# EAGLE schematic FINAL8x64 LED DIGITAL DISPLAY VERSION 1.0 CONNECTION REMANING v8 (EAGLE 9.7.0)
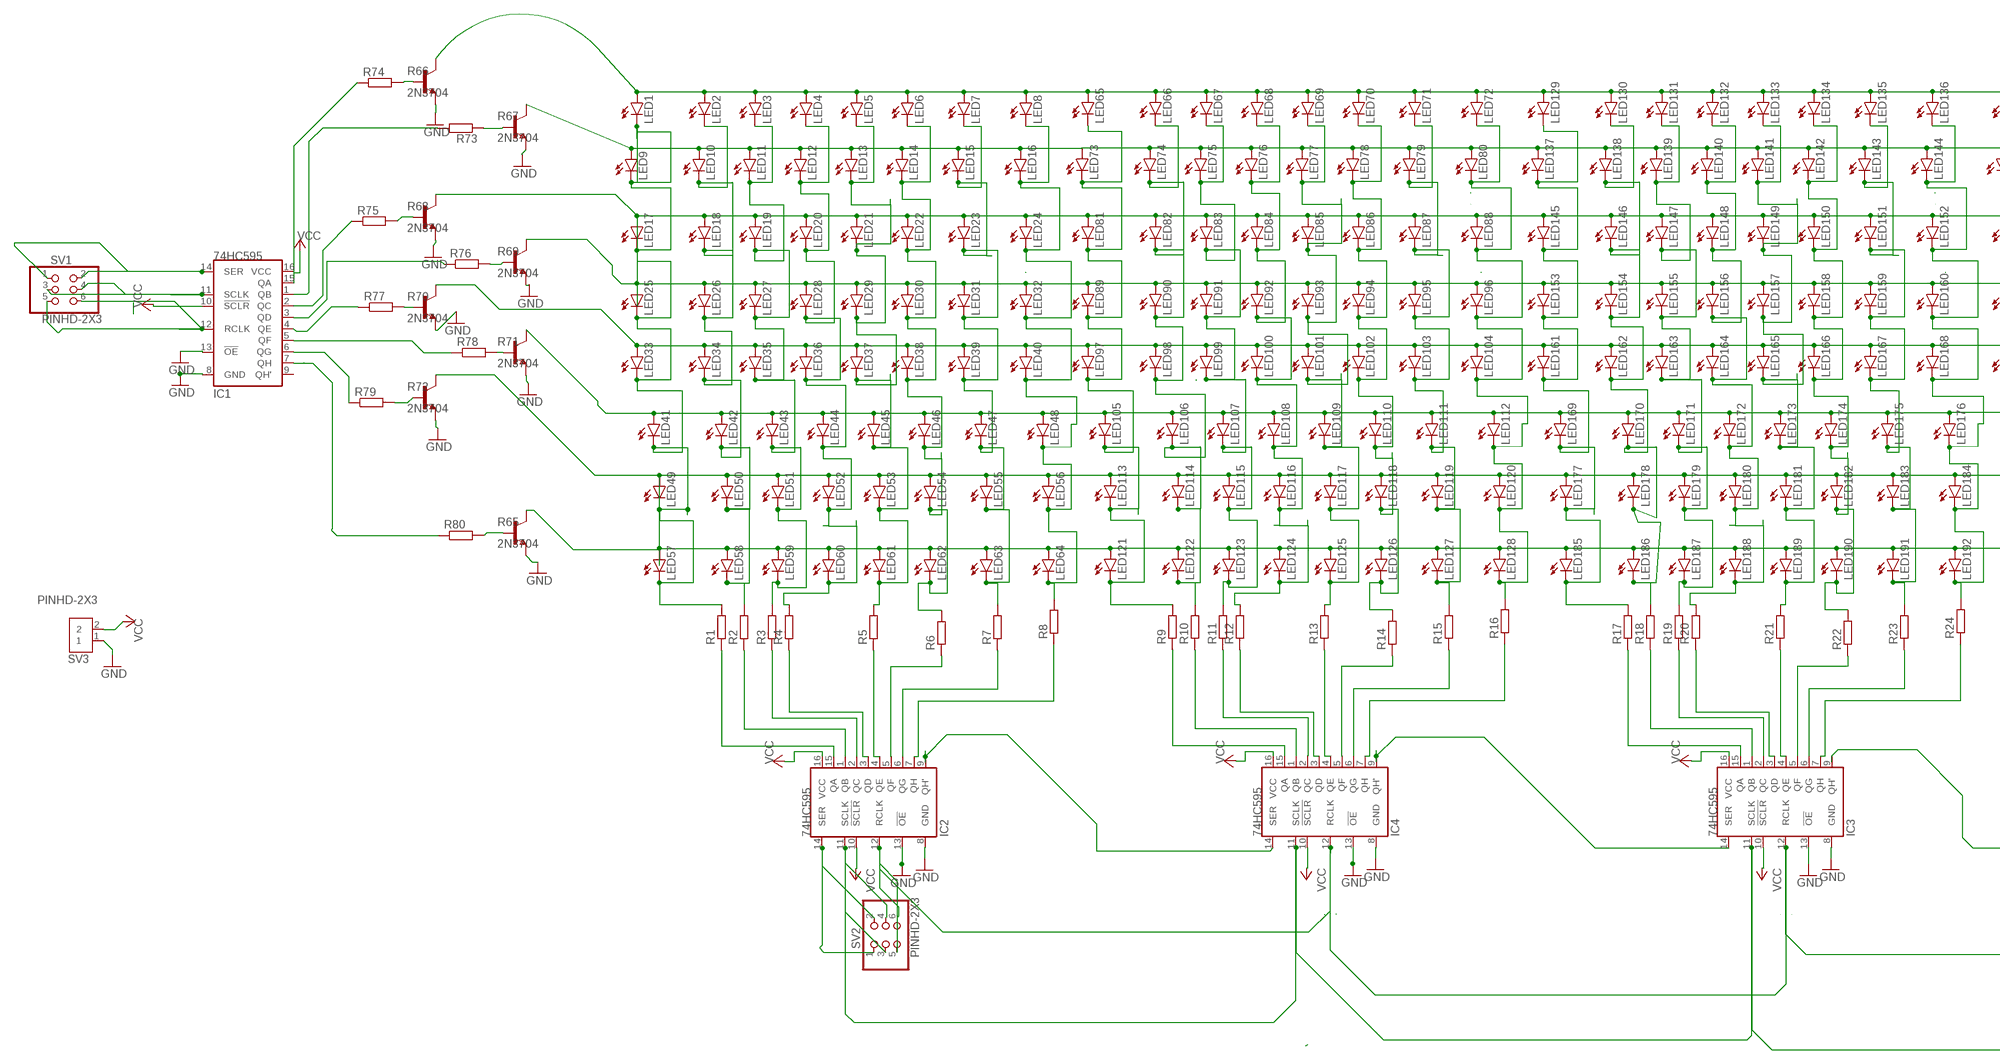
[diagram p0: schematic, sheet 1, part 1 of 2]
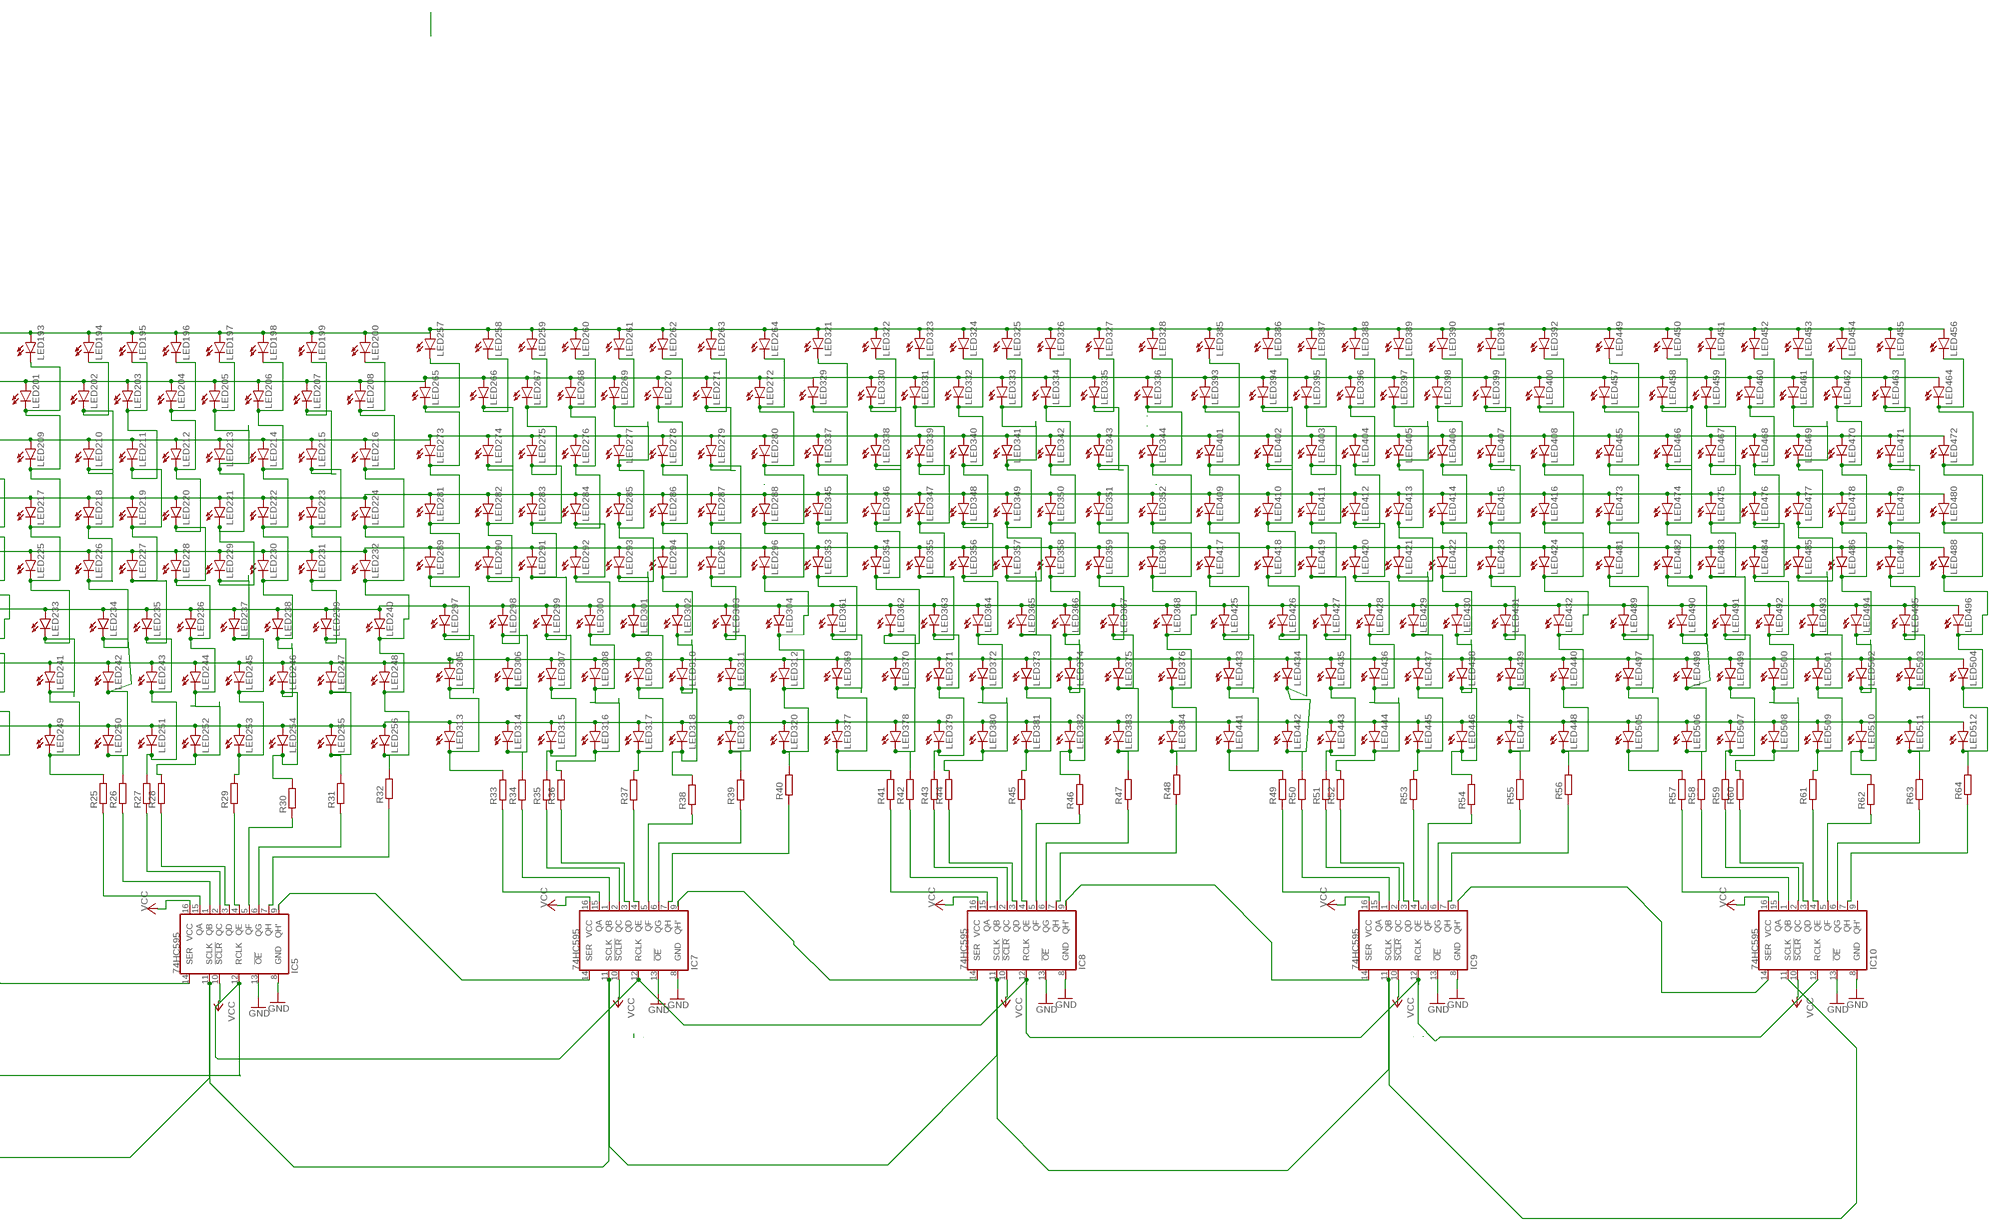
[diagram p1: schematic, sheet 1, part 2 of 2]

## Parts
IC1  74HC595  [SO16]
IC2  74HC595  [SO16]
IC3  74HC595  [SO16]
IC4  74HC595  [SO16]
IC5  74HC595  [SO16]
IC7  74HC595  [SO16]
IC8  74HC595  [SO16]
IC9  74HC595  [SO16]
IC10  74HC595  [SO16]
LED1  LED5MM  [LED5MM]
LED2  LED5MM  [LED5MM]
LED3  LED5MM  [LED5MM]
LED4  LED5MM  [LED5MM]
LED5  LED5MM  [LED5MM]
LED6  LED5MM  [LED5MM]
LED7  LED5MM  [LED5MM]
LED8  LED5MM  [LED5MM]
LED9  LED5MM  [LED5MM]
LED10  LED5MM  [LED5MM]
LED11  LED5MM  [LED5MM]
LED12  LED5MM  [LED5MM]
LED13  LED5MM  [LED5MM]
LED14  LED5MM  [LED5MM]
LED15  LED5MM  [LED5MM]
LED16  LED5MM  [LED5MM]
LED17  LED5MM  [LED5MM]
LED18  LED5MM  [LED5MM]
LED19  LED5MM  [LED5MM]
LED20  LED5MM  [LED5MM]
LED21  LED5MM  [LED5MM]
LED22  LED5MM  [LED5MM]
LED23  LED5MM  [LED5MM]
LED24  LED5MM  [LED5MM]
LED25  LED5MM  [LED5MM]
LED26  LED5MM  [LED5MM]
LED27  LED5MM  [LED5MM]
LED28  LED5MM  [LED5MM]
LED29  LED5MM  [LED5MM]
LED30  LED5MM  [LED5MM]
LED31  LED5MM  [LED5MM]
LED32  LED5MM  [LED5MM]
LED33  LED5MM  [LED5MM]
LED34  LED5MM  [LED5MM]
LED35  LED5MM  [LED5MM]
LED36  LED5MM  [LED5MM]
LED37  LED5MM  [LED5MM]
LED38  LED5MM  [LED5MM]
LED39  LED5MM  [LED5MM]
LED40  LED5MM  [LED5MM]
LED41  LED5MM  [LED5MM]
LED42  LED5MM  [LED5MM]
LED43  LED5MM  [LED5MM]
LED44  LED5MM  [LED5MM]
LED45  LED5MM  [LED5MM]
LED46  LED5MM  [LED5MM]
LED47  LED5MM  [LED5MM]
LED48  LED5MM  [LED5MM]
LED49  LED5MM  [LED5MM]
LED50  LED5MM  [LED5MM]
LED51  LED5MM  [LED5MM]
LED52  LED5MM  [LED5MM]
LED53  LED5MM  [LED5MM]
LED54  LED5MM  [LED5MM]
LED55  LED5MM  [LED5MM]
LED56  LED5MM  [LED5MM]
LED57  LED5MM  [LED5MM]
LED58  LED5MM  [LED5MM]
LED59  LED5MM  [LED5MM]
LED60  LED5MM  [LED5MM]
LED61  LED5MM  [LED5MM]
LED62  LED5MM  [LED5MM]
LED63  LED5MM  [LED5MM]
LED64  LED5MM  [LED5MM]
LED65  LED5MM  [LED5MM]
LED66  LED5MM  [LED5MM]
LED67  LED5MM  [LED5MM]
LED68  LED5MM  [LED5MM]
LED69  LED5MM  [LED5MM]
LED70  LED5MM  [LED5MM]
LED71  LED5MM  [LED5MM]
LED72  LED5MM  [LED5MM]
LED73  LED5MM  [LED5MM]
LED74  LED5MM  [LED5MM]
LED75  LED5MM  [LED5MM]
LED76  LED5MM  [LED5MM]
LED77  LED5MM  [LED5MM]
LED78  LED5MM  [LED5MM]
LED79  LED5MM  [LED5MM]
LED80  LED5MM  [LED5MM]
LED81  LED5MM  [LED5MM]
LED82  LED5MM  [LED5MM]
LED83  LED5MM  [LED5MM]
LED84  LED5MM  [LED5MM]
LED85  LED5MM  [LED5MM]
LED86  LED5MM  [LED5MM]
LED87  LED5MM  [LED5MM]
LED88  LED5MM  [LED5MM]
LED89  LED5MM  [LED5MM]
LED90  LED5MM  [LED5MM]
LED91  LED5MM  [LED5MM]
LED92  LED5MM  [LED5MM]
LED93  LED5MM  [LED5MM]
LED94  LED5MM  [LED5MM]
LED95  LED5MM  [LED5MM]
LED96  LED5MM  [LED5MM]
LED97  LED5MM  [LED5MM]
LED98  LED5MM  [LED5MM]
LED99  LED5MM  [LED5MM]
LED100  LED5MM  [LED5MM]
LED101  LED5MM  [LED5MM]
LED102  LED5MM  [LED5MM]
LED103  LED5MM  [LED5MM]
LED104  LED5MM  [LED5MM]
LED105  LED5MM  [LED5MM]
LED106  LED5MM  [LED5MM]
LED107  LED5MM  [LED5MM]
LED108  LED5MM  [LED5MM]
LED109  LED5MM  [LED5MM]
LED110  LED5MM  [LED5MM]
LED111  LED5MM  [LED5MM]
LED112  LED5MM  [LED5MM]
LED113  LED5MM  [LED5MM]
LED114  LED5MM  [LED5MM]
LED115  LED5MM  [LED5MM]
LED116  LED5MM  [LED5MM]
LED117  LED5MM  [LED5MM]
LED118  LED5MM  [LED5MM]
LED119  LED5MM  [LED5MM]
LED120  LED5MM  [LED5MM]
LED121  LED5MM  [LED5MM]
LED122  LED5MM  [LED5MM]
LED123  LED5MM  [LED5MM]
LED124  LED5MM  [LED5MM]
LED125  LED5MM  [LED5MM]
LED126  LED5MM  [LED5MM]
LED127  LED5MM  [LED5MM]
LED128  LED5MM  [LED5MM]
LED129  LED5MM  [LED5MM]
LED130  LED5MM  [LED5MM]
LED131  LED5MM  [LED5MM]
LED132  LED5MM  [LED5MM]
LED133  LED5MM  [LED5MM]
LED134  LED5MM  [LED5MM]
LED135  LED5MM  [LED5MM]
LED136  LED5MM  [LED5MM]
LED137  LED5MM  [LED5MM]
LED138  LED5MM  [LED5MM]
LED139  LED5MM  [LED5MM]
LED140  LED5MM  [LED5MM]
LED141  LED5MM  [LED5MM]
LED142  LED5MM  [LED5MM]
LED143  LED5MM  [LED5MM]
LED144  LED5MM  [LED5MM]
LED145  LED5MM  [LED5MM]
LED146  LED5MM  [LED5MM]
LED147  LED5MM  [LED5MM]
LED148  LED5MM  [LED5MM]
LED149  LED5MM  [LED5MM]
LED150  LED5MM  [LED5MM]
LED151  LED5MM  [LED5MM]
LED152  LED5MM  [LED5MM]
LED153  LED5MM  [LED5MM]
LED154  LED5MM  [LED5MM]
LED155  LED5MM  [LED5MM]
LED156  LED5MM  [LED5MM]
LED157  LED5MM  [LED5MM]
LED158  LED5MM  [LED5MM]
LED159  LED5MM  [LED5MM]
LED160  LED5MM  [LED5MM]
LED161  LED5MM  [LED5MM]
LED162  LED5MM  [LED5MM]
LED163  LED5MM  [LED5MM]
LED164  LED5MM  [LED5MM]
LED165  LED5MM  [LED5MM]
LED166  LED5MM  [LED5MM]
LED167  LED5MM  [LED5MM]
LED168  LED5MM  [LED5MM]
LED169  LED5MM  [LED5MM]
LED170  LED5MM  [LED5MM]
LED171  LED5MM  [LED5MM]
LED172  LED5MM  [LED5MM]
LED173  LED5MM  [LED5MM]
LED174  LED5MM  [LED5MM]
LED175  LED5MM  [LED5MM]
LED176  LED5MM  [LED5MM]
LED177  LED5MM  [LED5MM]
LED178  LED5MM  [LED5MM]
LED179  LED5MM  [LED5MM]
LED180  LED5MM  [LED5MM]
LED181  LED5MM  [LED5MM]
LED182  LED5MM  [LED5MM]
LED183  LED5MM  [LED5MM]
LED184  LED5MM  [LED5MM]
LED185  LED5MM  [LED5MM]
LED186  LED5MM  [LED5MM]
LED187  LED5MM  [LED5MM]
LED188  LED5MM  [LED5MM]
LED189  LED5MM  [LED5MM]
LED190  LED5MM  [LED5MM]
LED191  LED5MM  [LED5MM]
LED192  LED5MM  [LED5MM]
LED193  LED5MM  [LED5MM]
LED194  LED5MM  [LED5MM]
LED195  LED5MM  [LED5MM]
LED196  LED5MM  [LED5MM]
LED197  LED5MM  [LED5MM]
LED198  LED5MM  [LED5MM]
LED199  LED5MM  [LED5MM]
LED200  LED5MM  [LED5MM]
LED201  LED5MM  [LED5MM]
LED202  LED5MM  [LED5MM]
LED203  LED5MM  [LED5MM]
LED204  LED5MM  [LED5MM]
LED205  LED5MM  [LED5MM]
LED206  LED5MM  [LED5MM]
LED207  LED5MM  [LED5MM]
LED208  LED5MM  [LED5MM]
LED209  LED5MM  [LED5MM]
LED210  LED5MM  [LED5MM]
LED211  LED5MM  [LED5MM]
LED212  LED5MM  [LED5MM]
LED213  LED5MM  [LED5MM]
LED214  LED5MM  [LED5MM]
LED215  LED5MM  [LED5MM]
LED216  LED5MM  [LED5MM]
LED217  LED5MM  [LED5MM]
LED218  LED5MM  [LED5MM]
LED219  LED5MM  [LED5MM]
LED220  LED5MM  [LED5MM]
LED221  LED5MM  [LED5MM]
LED222  LED5MM  [LED5MM]
LED223  LED5MM  [LED5MM]
LED224  LED5MM  [LED5MM]
LED225  LED5MM  [LED5MM]
LED226  LED5MM  [LED5MM]
LED227  LED5MM  [LED5MM]
LED228  LED5MM  [LED5MM]
LED229  LED5MM  [LED5MM]
LED230  LED5MM  [LED5MM]
LED231  LED5MM  [LED5MM]
LED232  LED5MM  [LED5MM]
LED233  LED5MM  [LED5MM]
LED234  LED5MM  [LED5MM]
LED235  LED5MM  [LED5MM]
LED236  LED5MM  [LED5MM]
LED237  LED5MM  [LED5MM]
LED238  LED5MM  [LED5MM]
LED239  LED5MM  [LED5MM]
LED240  LED5MM  [LED5MM]
LED241  LED5MM  [LED5MM]
LED242  LED5MM  [LED5MM]
LED243  LED5MM  [LED5MM]
LED244  LED5MM  [LED5MM]
LED245  LED5MM  [LED5MM]
LED246  LED5MM  [LED5MM]
LED247  LED5MM  [LED5MM]
LED248  LED5MM  [LED5MM]
LED249  LED5MM  [LED5MM]
LED250  LED5MM  [LED5MM]
LED251  LED5MM  [LED5MM]
LED252  LED5MM  [LED5MM]
LED253  LED5MM  [LED5MM]
LED254  LED5MM  [LED5MM]
LED255  LED5MM  [LED5MM]
LED256  LED5MM  [LED5MM]
LED257  LED5MM  [LED5MM]
LED258  LED5MM  [LED5MM]
LED259  LED5MM  [LED5MM]
LED260  LED5MM  [LED5MM]
LED261  LED5MM  [LED5MM]
LED262  LED5MM  [LED5MM]
LED263  LED5MM  [LED5MM]
LED264  LED5MM  [LED5MM]
LED265  LED5MM  [LED5MM]
LED266  LED5MM  [LED5MM]
LED267  LED5MM  [LED5MM]
LED268  LED5MM  [LED5MM]
LED269  LED5MM  [LED5MM]
LED270  LED5MM  [LED5MM]
LED271  LED5MM  [LED5MM]
LED272  LED5MM  [LED5MM]
LED273  LED5MM  [LED5MM]
LED274  LED5MM  [LED5MM]
LED275  LED5MM  [LED5MM]
LED276  LED5MM  [LED5MM]
LED277  LED5MM  [LED5MM]
LED278  LED5MM  [LED5MM]
LED279  LED5MM  [LED5MM]
LED280  LED5MM  [LED5MM]
LED281  LED5MM  [LED5MM]
LED282  LED5MM  [LED5MM]
LED283  LED5MM  [LED5MM]
LED284  LED5MM  [LED5MM]
LED285  LED5MM  [LED5MM]
LED286  LED5MM  [LED5MM]
LED287  LED5MM  [LED5MM]
LED288  LED5MM  [LED5MM]
LED289  LED5MM  [LED5MM]
LED290  LED5MM  [LED5MM]
LED291  LED5MM  [LED5MM]
LED292  LED5MM  [LED5MM]
LED293  LED5MM  [LED5MM]
LED294  LED5MM  [LED5MM]
LED295  LED5MM  [LED5MM]
LED296  LED5MM  [LED5MM]
LED297  LED5MM  [LED5MM]
LED298  LED5MM  [LED5MM]
LED299  LED5MM  [LED5MM]
LED300  LED5MM  [LED5MM]
LED301  LED5MM  [LED5MM]
LED302  LED5MM  [LED5MM]
LED303  LED5MM  [LED5MM]
LED304  LED5MM  [LED5MM]
LED305  LED5MM  [LED5MM]
LED306  LED5MM  [LED5MM]
LED307  LED5MM  [LED5MM]
LED308  LED5MM  [LED5MM]
LED309  LED5MM  [LED5MM]
LED310  LED5MM  [LED5MM]
LED311  LED5MM  [LED5MM]
LED312  LED5MM  [LED5MM]
LED313  LED5MM  [LED5MM]
LED314  LED5MM  [LED5MM]
LED315  LED5MM  [LED5MM]
LED316  LED5MM  [LED5MM]
LED317  LED5MM  [LED5MM]
LED318  LED5MM  [LED5MM]
LED319  LED5MM  [LED5MM]
LED320  LED5MM  [LED5MM]
LED321  LED5MM  [LED5MM]
LED322  LED5MM  [LED5MM]
LED323  LED5MM  [LED5MM]
LED324  LED5MM  [LED5MM]
LED325  LED5MM  [LED5MM]
LED326  LED5MM  [LED5MM]
LED327  LED5MM  [LED5MM]
LED328  LED5MM  [LED5MM]
LED329  LED5MM  [LED5MM]
LED330  LED5MM  [LED5MM]
LED331  LED5MM  [LED5MM]
LED332  LED5MM  [LED5MM]
LED333  LED5MM  [LED5MM]
LED334  LED5MM  [LED5MM]
LED335  LED5MM  [LED5MM]
LED336  LED5MM  [LED5MM]
LED337  LED5MM  [LED5MM]
LED338  LED5MM  [LED5MM]
LED339  LED5MM  [LED5MM]
LED340  LED5MM  [LED5MM]
LED341  LED5MM  [LED5MM]
LED342  LED5MM  [LED5MM]
LED343  LED5MM  [LED5MM]
LED344  LED5MM  [LED5MM]
LED345  LED5MM  [LED5MM]
LED346  LED5MM  [LED5MM]
LED347  LED5MM  [LED5MM]
LED348  LED5MM  [LED5MM]
LED349  LED5MM  [LED5MM]
LED350  LED5MM  [LED5MM]
LED351  LED5MM  [LED5MM]
LED352  LED5MM  [LED5MM]
LED353  LED5MM  [LED5MM]
LED354  LED5MM  [LED5MM]
LED355  LED5MM  [LED5MM]
LED356  LED5MM  [LED5MM]
LED357  LED5MM  [LED5MM]
LED358  LED5MM  [LED5MM]
LED359  LED5MM  [LED5MM]
LED360  LED5MM  [LED5MM]
LED361  LED5MM  [LED5MM]
LED362  LED5MM  [LED5MM]
LED363  LED5MM  [LED5MM]
LED364  LED5MM  [LED5MM]
LED365  LED5MM  [LED5MM]
LED366  LED5MM  [LED5MM]
LED367  LED5MM  [LED5MM]
LED368  LED5MM  [LED5MM]
LED369  LED5MM  [LED5MM]
LED370  LED5MM  [LED5MM]
LED371  LED5MM  [LED5MM]
LED372  LED5MM  [LED5MM]
LED373  LED5MM  [LED5MM]
LED374  LED5MM  [LED5MM]
LED375  LED5MM  [LED5MM]
LED376  LED5MM  [LED5MM]
LED377  LED5MM  [LED5MM]
LED378  LED5MM  [LED5MM]
LED379  LED5MM  [LED5MM]
LED380  LED5MM  [LED5MM]
LED381  LED5MM  [LED5MM]
LED382  LED5MM  [LED5MM]
LED383  LED5MM  [LED5MM]
LED384  LED5MM  [LED5MM]
LED385  LED5MM  [LED5MM]
LED386  LED5MM  [LED5MM]
LED387  LED5MM  [LED5MM]
LED388  LED5MM  [LED5MM]
LED389  LED5MM  [LED5MM]
LED390  LED5MM  [LED5MM]
LED391  LED5MM  [LED5MM]
LED392  LED5MM  [LED5MM]
LED393  LED5MM  [LED5MM]
LED394  LED5MM  [LED5MM]
LED395  LED5MM  [LED5MM]
LED396  LED5MM  [LED5MM]
LED397  LED5MM  [LED5MM]
LED398  LED5MM  [LED5MM]
LED399  LED5MM  [LED5MM]
LED400  LED5MM  [LED5MM]
LED401  LED5MM  [LED5MM]
LED402  LED5MM  [LED5MM]
LED403  LED5MM  [LED5MM]
LED404  LED5MM  [LED5MM]
LED405  LED5MM  [LED5MM]
LED406  LED5MM  [LED5MM]
LED407  LED5MM  [LED5MM]
LED408  LED5MM  [LED5MM]
LED409  LED5MM  [LED5MM]
LED410  LED5MM  [LED5MM]
LED411  LED5MM  [LED5MM]
LED412  LED5MM  [LED5MM]
LED413  LED5MM  [LED5MM]
LED414  LED5MM  [LED5MM]
LED415  LED5MM  [LED5MM]
LED416  LED5MM  [LED5MM]
LED417  LED5MM  [LED5MM]
LED418  LED5MM  [LED5MM]
LED419  LED5MM  [LED5MM]
LED420  LED5MM  [LED5MM]
LED421  LED5MM  [LED5MM]
LED422  LED5MM  [LED5MM]
LED423  LED5MM  [LED5MM]
LED424  LED5MM  [LED5MM]
LED425  LED5MM  [LED5MM]
LED426  LED5MM  [LED5MM]
LED427  LED5MM  [LED5MM]
LED428  LED5MM  [LED5MM]
LED429  LED5MM  [LED5MM]
LED430  LED5MM  [LED5MM]
LED431  LED5MM  [LED5MM]
LED432  LED5MM  [LED5MM]
LED433  LED5MM  [LED5MM]
LED434  LED5MM  [LED5MM]
LED435  LED5MM  [LED5MM]
LED436  LED5MM  [LED5MM]
LED437  LED5MM  [LED5MM]
LED438  LED5MM  [LED5MM]
LED439  LED5MM  [LED5MM]
LED440  LED5MM  [LED5MM]
LED441  LED5MM  [LED5MM]
LED442  LED5MM  [LED5MM]
LED443  LED5MM  [LED5MM]
LED444  LED5MM  [LED5MM]
LED445  LED5MM  [LED5MM]
LED446  LED5MM  [LED5MM]
LED447  LED5MM  [LED5MM]
LED448  LED5MM  [LED5MM]
LED449  LED5MM  [LED5MM]
LED450  LED5MM  [LED5MM]
LED451  LED5MM  [LED5MM]
LED452  LED5MM  [LED5MM]
LED453  LED5MM  [LED5MM]
LED454  LED5MM  [LED5MM]
LED455  LED5MM  [LED5MM]
LED456  LED5MM  [LED5MM]
LED457  LED5MM  [LED5MM]
LED458  LED5MM  [LED5MM]
LED459  LED5MM  [LED5MM]
LED460  LED5MM  [LED5MM]
LED461  LED5MM  [LED5MM]
LED462  LED5MM  [LED5MM]
LED463  LED5MM  [LED5MM]
LED464  LED5MM  [LED5MM]
LED465  LED5MM  [LED5MM]
LED466  LED5MM  [LED5MM]
LED467  LED5MM  [LED5MM]
LED468  LED5MM  [LED5MM]
LED469  LED5MM  [LED5MM]
LED470  LED5MM  [LED5MM]
LED471  LED5MM  [LED5MM]
LED472  LED5MM  [LED5MM]
LED473  LED5MM  [LED5MM]
LED474  LED5MM  [LED5MM]
LED475  LED5MM  [LED5MM]
LED476  LED5MM  [LED5MM]
LED477  LED5MM  [LED5MM]
LED478  LED5MM  [LED5MM]
LED479  LED5MM  [LED5MM]
LED480  LED5MM  [LED5MM]
LED481  LED5MM  [LED5MM]
LED482  LED5MM  [LED5MM]
LED483  LED5MM  [LED5MM]
LED484  LED5MM  [LED5MM]
LED485  LED5MM  [LED5MM]
LED486  LED5MM  [LED5MM]
LED487  LED5MM  [LED5MM]
LED488  LED5MM  [LED5MM]
LED489  LED5MM  [LED5MM]
LED490  LED5MM  [LED5MM]
LED491  LED5MM  [LED5MM]
LED492  LED5MM  [LED5MM]
LED493  LED5MM  [LED5MM]
LED494  LED5MM  [LED5MM]
LED495  LED5MM  [LED5MM]
LED496  LED5MM  [LED5MM]
LED497  LED5MM  [LED5MM]
LED498  LED5MM  [LED5MM]
LED499  LED5MM  [LED5MM]
LED500  LED5MM  [LED5MM]
LED501  LED5MM  [LED5MM]
LED502  LED5MM  [LED5MM]
LED503  LED5MM  [LED5MM]
LED504  LED5MM  [LED5MM]
LED505  LED5MM  [LED5MM]
LED506  LED5MM  [LED5MM]
LED507  LED5MM  [LED5MM]
LED508  LED5MM  [LED5MM]
LED509  LED5MM  [LED5MM]
LED510  LED5MM  [LED5MM]
LED511  LED5MM  [LED5MM]
LED512  LED5MM  [LED5MM]
R1  R-EU_0204/7  [0204/7]
R2  R-EU_0204/7  [0204/7]
R3  R-EU_0204/7  [0204/7]
R4  R-EU_0204/7  [0204/7]
R5  R-EU_0204/7  [0204/7]
R6  R-EU_0204/7  [0204/7]
R7  R-EU_0204/7  [0204/7]
R8  R-EU_0204/7  [0204/7]
R9  R-EU_0204/7  [0204/7]
R10  R-EU_0204/7  [0204/7]
R11  R-EU_0204/7  [0204/7]
R12  R-EU_0204/7  [0204/7]
R13  R-EU_0204/7  [0204/7]
R14  R-EU_0204/7  [0204/7]
R15  R-EU_0204/7  [0204/7]
R16  R-EU_0204/7  [0204/7]
R17  R-EU_0204/7  [0204/7]
R18  R-EU_0204/7  [0204/7]
R19  R-EU_0204/7  [0204/7]
R20  R-EU_0204/7  [0204/7]
R21  R-EU_0204/7  [0204/7]
R22  R-EU_0204/7  [0204/7]
R23  R-EU_0204/7  [0204/7]
R24  R-EU_0204/7  [0204/7]
R25  R-EU_0204/7  [0204/7]
R26  R-EU_0204/7  [0204/7]
R27  R-EU_0204/7  [0204/7]
R28  R-EU_0204/7  [0204/7]
R29  R-EU_0204/7  [0204/7]
R30  R-EU_0204/7  [0204/7]
R31  R-EU_0204/7  [0204/7]
R32  R-EU_0204/7  [0204/7]
R33  R-EU_0204/7  [0204/7]
R34  R-EU_0204/7  [0204/7]
R35  R-EU_0204/7  [0204/7]
R36  R-EU_0204/7  [0204/7]
R37  R-EU_0204/7  [0204/7]
R38  R-EU_0204/7  [0204/7]
R39  R-EU_0204/7  [0204/7]
R40  R-EU_0204/7  [0204/7]
R41  R-EU_0204/7  [0204/7]
R42  R-EU_0204/7  [0204/7]
R43  R-EU_0204/7  [0204/7]
R44  R-EU_0204/7  [0204/7]
R45  R-EU_0204/7  [0204/7]
R46  R-EU_0204/7  [0204/7]
R47  R-EU_0204/7  [0204/7]
R48  R-EU_0204/7  [0204/7]
R49  R-EU_0204/7  [0204/7]
R50  R-EU_0204/7  [0204/7]
R51  R-EU_0204/7  [0204/7]
R52  R-EU_0204/7  [0204/7]
R53  R-EU_0204/7  [0204/7]
R54  R-EU_0204/7  [0204/7]
R55  R-EU_0204/7  [0204/7]
R56  R-EU_0204/7  [0204/7]
R57  R-EU_0204/7  [0204/7]
R58  R-EU_0204/7  [0204/7]
R59  R-EU_0204/7  [0204/7]
R60  R-EU_0204/7  [0204/7]
R61  R-EU_0204/7  [0204/7]
R62  R-EU_0204/7  [0204/7]
R63  R-EU_0204/7  [0204/7]
R64  R-EU_0204/7  [0204/7]
R65  2N3704  [TO92]
R66  2N3704  [TO92]
R67  2N3704  [TO92]
R68  2N3704  [TO92]
R69  2N3704  [TO92]
R70  2N3704  [TO92]
R71  2N3704  [TO92]
R72  2N3704  [TO92]
R73  R-EU_0204/7  [0204/7]
R74  R-EU_0204/7  [0204/7]
R75  R-EU_0204/7  [0204/7]
R76  R-EU_0204/7  [0204/7]
R77  R-EU_0204/7  [0204/7]
R78  R-EU_0204/7  [0204/7]
R79  R-EU_0204/7  [0204/7]
R80  R-EU_0204/7  [0204/7]
SV1  PINHD-2X3  [2X03]
SV2  PINHD-2X3  [2X03]
SV3  PINHD-2X3  2828XX-2282837-2  [TERMBLK_508-2N]

## Nets
GND: IC1.8(GND) IC1.13(!OE) IC2.8(GND) IC2.13(!OE) IC3.8(GND) IC3.13(!OE) IC4.8(GND) IC4.13(!OE) IC5.8(GND) IC5.13(!OE) IC7.8(GND) IC7.13(!OE) IC8.8(GND) IC8.13(!OE) IC9.8(GND) IC9.13(!OE) IC10.8(GND) IC10.13(!OE) R65.3(E) R66.3(E) R67.3(E) R68.3(E) R69.3(E) R70.3(E) R71.3(E) R72.3(E) SV3.1
N$1: R68.1(B) R75.2
N$2: LED9.A LED10.A LED11.A LED12.A LED13.A LED14.A LED15.A LED16.A LED73.A LED74.A LED75.A LED76.A LED77.A LED78.A LED79.A LED80.A LED137.A LED138.A LED139.A LED140.A LED141.A LED142.A LED143.A LED144.A LED201.A LED202.A LED203.A LED204.A LED205.A LED206.A LED207.A LED208.A LED265.A LED266.A LED267.A LED268.A LED269.A LED270.A LED271.A LED272.A LED329.A LED330.A LED331.A LED332.A LED333.A LED334.A LED335.A LED336.A LED393.A LED394.A LED395.A LED396.A LED397.A LED398.A LED399.A LED400.A LED457.A LED458.A LED459.A LED460.A LED461.A LED462.A LED463.A LED464.A R67.2(C)
N$3: IC2.9(QH') IC4.14(SER)
N$4: LED17.A LED18.A LED19.A LED20.A LED21.A LED22.A LED23.A LED24.A LED25.A LED26.A LED27.A LED28.A LED29.A LED30.A LED31.A LED32.A LED81.A LED82.A LED83.A LED84.A LED85.A LED86.A LED87.A LED88.A LED89.A LED90.A LED91.A LED92.A LED93.A LED94.A LED95.A LED96.A LED145.A LED146.A LED147.A LED148.A LED149.A LED150.A LED151.A LED152.A LED153.A LED154.A LED155.A LED156.A LED157.A LED158.A LED159.A LED160.A LED209.A LED210.A LED211.A LED212.A LED213.A LED214.A LED215.A LED216.A LED217.A LED218.A LED219.A LED220.A LED221.A LED222.A LED223.A LED224.A LED273.A LED274.A LED275.A LED276.A LED277.A LED278.A LED279.A LED280.A LED281.A LED282.A LED283.A LED284.A LED285.A LED286.A LED287.A LED288.A LED337.A LED338.A LED339.A LED340.A LED341.A LED342.A LED343.A LED344.A LED345.A LED346.A LED347.A LED348.A LED349.A LED350.A LED351.A LED352.A LED401.A LED402.A LED403.A LED404.A LED405.A LED406.A LED407.A LED408.A LED409.A LED410.A LED411.A LED412.A LED413.A LED414.A LED415.A LED416.A LED465.A LED466.A LED467.A LED468.A LED469.A LED470.A LED471.A LED472.A LED473.A LED474.A LED475.A LED476.A LED477.A LED478.A LED479.A LED480.A R68.2(C) R69.2(C)
N$5: LED33.A LED34.A LED35.A LED36.A LED37.A LED38.A LED39.A LED40.A LED97.A LED98.A LED99.A LED100.A LED101.A LED102.A LED103.A LED104.A LED161.A LED162.A LED163.A LED164.A LED165.A LED166.A LED167.A LED168.A LED225.A LED226.A LED227.A LED228.A LED229.A LED230.A LED231.A LED232.A LED289.A LED290.A LED291.A LED292.A LED293.A LED294.A LED295.A LED296.A LED353.A LED354.A LED355.A LED356.A LED357.A LED358.A LED359.A LED360.A LED417.A LED418.A LED419.A LED420.A LED421.A LED422.A LED423.A LED424.A LED481.A LED482.A LED483.A LED484.A LED485.A LED486.A LED487.A LED488.A R70.2(C)
N$6: IC1.15(QA) R74.1
N$7: IC3.9(QH') IC5.14(SER)
N$8: IC1.1(QB) R73.2
N$9: LED1.A LED2.A LED3.A LED4.A LED5.A LED6.A LED7.A LED8.A LED65.A LED66.A LED67.A LED68.A LED69.A LED70.A LED71.A LED72.A LED129.A LED130.A LED131.A LED132.A LED133.A LED134.A LED135.A LED136.A LED193.A LED194.A LED195.A LED196.A LED197.A LED198.A LED199.A LED200.A LED257.A LED258.A LED259.A LED260.A LED261.A LED262.A LED263.A LED264.A LED321.A LED322.A LED323.A LED324.A LED325.A LED326.A LED327.A LED328.A LED385.A LED386.A LED387.A LED388.A LED389.A LED390.A LED391.A LED392.A LED449.A LED450.A LED451.A LED452.A LED453.A LED454.A LED455.A LED456.A R66.2(C)
N$10: LED3.K(C) LED11.K(C) LED19.K(C) LED27.K(C) LED35.K(C) LED43.K(C) LED51.K(C) LED59.K(C) R3.2
N$11: LED4.K(C) LED12.K(C) LED20.K(C) LED28.K(C) LED36.K(C) LED44.K(C) LED52.K(C) LED60.K(C) R4.2
N$12: LED2.K(C) LED10.K(C) LED18.K(C) LED26.K(C) LED34.K(C) LED42.K(C) LED50.K(C) LED58.K(C) R2.2
N$13: LED5.K(C) LED13.K(C) LED21.K(C) LED29.K(C) LED37.K(C) LED45.K(C) LED53.K(C) LED61.K(C) R5.2
N$14: LED6.K(C) LED14.K(C) LED22.K(C) LED30.K(C) LED38.K(C) LED46.K(C) LED54.K(C) LED62.K(C) R6.2
N$15: LED7.K(C) LED15.K(C) LED23.K(C) LED31.K(C) LED39.K(C) LED47.K(C) LED55.K(C) LED63.K(C) R7.2
N$16: LED8.K(C) LED16.K(C) LED24.K(C) LED32.K(C) LED40.K(C) LED48.K(C) LED56.K(C) LED64.K(C) R8.2
N$17: IC2.15(QA) R1.1
N$18: IC2.1(QB) R2.1
N$19: IC2.2(QC) R3.1
N$20: IC2.3(QD) R4.1
N$21: IC2.4(QE) R5.1
N$22: IC2.5(QF) R6.1
N$23: IC2.6(QG) R7.1
N$24: IC2.7(QH) R8.1
N$25: IC2.14(SER) SV2.1 SV2.2
N$26: IC2.11(SCLK) IC3.11(SCLK) IC4.11(SCLK) IC5.11(SCLK) IC7.11(SCLK) IC8.11(SCLK) IC9.11(SCLK) IC10.11(SCLK) SV2.3
N$28: IC5.9(QH') IC7.14(SER)
N$29: SV2.4
N$31: IC1.11(SCLK) SV1.3 SV1.4
N$32: LED1.K(C) LED9.K(C) LED17.K(C) LED25.K(C) LED33.K(C) LED41.K(C) LED49.K(C) LED57.K(C) R1.2
N$33: IC1.12(RCLK) SV1.5 SV1.6
N$34: IC2.12(RCLK) IC3.12(RCLK) IC4.12(RCLK) IC5.12(RCLK) IC7.12(RCLK) IC8.12(RCLK) IC9.12(RCLK) IC10.12(RCLK) SV2.5 SV2.6
N$36: IC1.3(QD) R76.1
N$37: R66.1(B) R74.2
N$38: R71.1(B) R78.2
N$39: LED41.A LED42.A LED43.A LED44.A LED45.A LED46.A LED47.A LED48.A LED105.A LED106.A LED107.A LED108.A LED109.A LED110.A LED111.A LED112.A LED169.A LED170.A LED171.A LED172.A LED173.A LED174.A LED175.A LED176.A LED233.A LED234.A LED235.A LED236.A LED237.A LED238.A LED239.A LED240.A LED297.A LED298.A LED299.A LED300.A LED301.A LED302.A LED303.A LED304.A LED361.A LED362.A LED363.A LED364.A LED365.A LED366.A LED367.A LED368.A LED425.A LED426.A LED427.A LED428.A LED429.A LED430.A LED431.A LED432.A LED489.A LED490.A LED491.A LED492.A LED493.A LED494.A LED495.A LED496.A R71.2(C)
N$40: LED49.A LED50.A LED51.A LED52.A LED53.A LED54.A LED55.A LED56.A LED57.A LED58.A LED59.A LED60.A LED61.A LED62.A LED63.A LED64.A LED113.A LED114.A LED115.A LED116.A LED117.A LED118.A LED119.A LED120.A LED121.A LED122.A LED123.A LED124.A LED125.A LED126.A LED127.A LED128.A LED177.A LED178.A LED179.A LED180.A LED181.A LED182.A LED183.A LED184.A LED185.A LED186.A LED187.A LED188.A LED189.A LED190.A LED191.A LED192.A LED241.A LED242.A LED243.A LED244.A LED245.A LED246.A LED247.A LED248.A LED249.A LED250.A LED251.A LED252.A LED253.A LED254.A LED255.A LED256.A LED305.A LED306.A LED307.A LED308.A LED309.A LED310.A LED311.A LED312.A LED313.A LED314.A LED315.A LED316.A LED317.A LED318.A LED319.A LED320.A LED369.A LED370.A LED371.A LED372.A LED373.A LED374.A LED375.A LED376.A LED377.A LED378.A LED379.A LED380.A LED381.A LED382.A LED383.A LED384.A LED433.A LED434.A LED435.A LED436.A LED437.A LED438.A LED439.A LED440.A LED441.A LED442.A LED443.A LED444.A LED445.A LED446.A LED447.A LED448.A LED497.A LED498.A LED499.A LED500.A LED501.A LED502.A LED503.A LED504.A LED505.A LED506.A LED507.A LED508.A LED509.A LED510.A LED511.A LED512.A R65.2(C) R72.2(C)
N$41: LED257.K(C) LED265.K(C) LED273.K(C) LED281.K(C) LED289.K(C) LED297.K(C) LED305.K(C) LED313.K(C) R33.2
N$42: LED65.K(C) LED73.K(C) LED81.K(C) LED89.K(C) LED97.K(C) LED105.K(C) LED113.K(C) LED121.K(C) R9.2
N$43: LED194.K(C) LED202.K(C) LED210.K(C) LED218.K(C) LED226.K(C) LED234.K(C) LED242.K(C) LED250.K(C) R26.2
N$44: LED67.K(C) LED75.K(C) LED83.K(C) LED91.K(C) LED99.K(C) LED107.K(C) LED115.K(C) LED123.K(C) R11.2
N$45: LED68.K(C) LED76.K(C) LED84.K(C) LED92.K(C) LED100.K(C) LED108.K(C) LED116.K(C) LED124.K(C) R12.2
N$46: LED69.K(C) LED77.K(C) LED85.K(C) LED93.K(C) LED101.K(C) LED109.K(C) LED117.K(C) LED125.K(C) R13.2
N$47: LED70.K(C) LED78.K(C) LED86.K(C) LED94.K(C) LED102.K(C) LED110.K(C) LED118.K(C) LED126.K(C) R14.2
N$48: LED71.K(C) LED79.K(C) LED87.K(C) LED95.K(C) LED103.K(C) LED111.K(C) LED119.K(C) LED127.K(C) R15.2
N$49: LED72.K(C) LED80.K(C) LED88.K(C) LED96.K(C) LED104.K(C) LED112.K(C) LED120.K(C) LED128.K(C) R16.2
N$50: IC4.15(QA) R9.1
N$51: IC4.1(QB) R10.1
N$52: IC4.2(QC) R11.1
N$53: IC4.3(QD) R12.1
N$54: IC4.4(QE) R13.1
N$55: IC4.5(QF) R14.1
N$56: IC4.6(QG) R15.1
N$57: IC4.7(QH) R16.1
N$58: IC7.9(QH') IC8.14(SER)
N$62: IC1.2(QC) R75.1
N$63: LED258.K(C) LED266.K(C) LED274.K(C) LED282.K(C) LED290.K(C) LED298.K(C) LED306.K(C) LED314.K(C) R34.2
N$66: IC3.14(SER) IC4.9(QH')
N$68: LED66.K(C) LED74.K(C) LED82.K(C) LED90.K(C) LED98.K(C) LED106.K(C) LED114.K(C) LED122.K(C) R10.2
N$69: LED259.K(C) LED267.K(C) LED275.K(C) LED283.K(C) LED291.K(C) LED299.K(C) LED307.K(C) LED315.K(C) R35.2
N$70: LED260.K(C) LED268.K(C) LED276.K(C) LED284.K(C) LED292.K(C) LED300.K(C) LED308.K(C) LED316.K(C) R36.2
N$71: LED261.K(C) LED269.K(C) LED277.K(C) LED285.K(C) LED293.K(C) LED301.K(C) LED309.K(C) LED317.K(C) R37.2
N$72: LED262.K(C) LED270.K(C) LED278.K(C) LED286.K(C) LED294.K(C) LED302.K(C) LED310.K(C) LED318.K(C) R38.2
N$73: LED263.K(C) LED271.K(C) LED279.K(C) LED287.K(C) LED295.K(C) LED303.K(C) LED311.K(C) LED319.K(C) R39.2
N$74: LED129.K(C) LED137.K(C) LED145.K(C) LED153.K(C) LED161.K(C) LED169.K(C) LED177.K(C) LED185.K(C) R17.2
N$75: LED130.K(C) LED138.K(C) LED146.K(C) LED154.K(C) LED162.K(C) LED170.K(C) LED178.K(C) LED186.K(C) R18.2
N$76: LED131.K(C) LED139.K(C) LED147.K(C) LED155.K(C) LED163.K(C) LED171.K(C) LED179.K(C) LED187.K(C) R19.2
N$77: LED132.K(C) LED140.K(C) LED148.K(C) LED156.K(C) LED164.K(C) LED172.K(C) LED180.K(C) LED188.K(C) R20.2
N$78: LED133.K(C) LED141.K(C) LED149.K(C) LED157.K(C) LED165.K(C) LED173.K(C) LED181.K(C) LED189.K(C) R21.2
N$79: LED134.K(C) LED142.K(C) LED150.K(C) LED158.K(C) LED166.K(C) LED174.K(C) LED182.K(C) LED190.K(C) R22.2
N$80: LED135.K(C) LED143.K(C) LED151.K(C) LED159.K(C) LED167.K(C) LED175.K(C) LED183.K(C) LED191.K(C) R23.2
N$81: LED136.K(C) LED144.K(C) LED152.K(C) LED160.K(C) LED168.K(C) LED176.K(C) LED184.K(C) LED192.K(C) R24.2
N$82: IC3.15(QA) R17.1
N$83: IC3.1(QB) R18.1
N$84: IC3.2(QC) R19.1
N$85: IC3.3(QD) R20.1
N$86: IC3.4(QE) R21.1
N$87: IC3.5(QF) R22.1
N$88: IC3.6(QG) R23.1
N$89: IC3.7(QH) R24.1
N$90: IC8.9(QH') IC9.14(SER)
N$92: IC1.14(SER) SV1.1 SV1.2
N$93: IC9.9(QH') IC10.14(SER)
N$97: LED193.K(C) LED201.K(C) LED209.K(C) LED217.K(C) LED225.K(C) LED233.K(C) LED241.K(C) LED249.K(C) R25.2
N$98: LED264.K(C) LED272.K(C) LED280.K(C) LED288.K(C) LED296.K(C) LED304.K(C) LED312.K(C) LED320.K(C) R40.2
N$99: LED195.K(C) LED203.K(C) LED211.K(C) LED219.K(C) LED227.K(C) LED235.K(C) LED243.K(C) LED251.K(C) R27.2
N$100: LED196.K(C) LED204.K(C) LED212.K(C) LED220.K(C) LED228.K(C) LED236.K(C) LED244.K(C) LED252.K(C) R28.2
N$101: LED197.K(C) LED205.K(C) LED213.K(C) LED221.K(C) LED229.K(C) LED237.K(C) LED245.K(C) LED253.K(C) R29.2
N$102: LED198.K(C) LED206.K(C) LED214.K(C) LED222.K(C) LED230.K(C) LED238.K(C) LED246.K(C) LED254.K(C) R30.2
N$103: LED199.K(C) LED207.K(C) LED215.K(C) LED223.K(C) LED231.K(C) LED239.K(C) LED247.K(C) LED255.K(C) R31.2
N$104: LED200.K(C) LED208.K(C) LED216.K(C) LED224.K(C) LED232.K(C) LED240.K(C) LED248.K(C) LED256.K(C) R32.2
N$105: IC5.15(QA) R25.1
N$106: IC5.1(QB) R26.1
N$107: IC5.2(QC) R27.1
N$108: IC5.3(QD) R28.1
N$109: IC5.4(QE) R29.1
N$110: IC5.5(QF) R30.1
N$111: IC5.6(QG) R31.1
N$112: IC5.7(QH) R32.1
N$120: IC7.15(QA) R33.1
N$121: IC7.1(QB) R34.1
N$122: IC7.2(QC) R35.1
N$123: IC7.3(QD) R36.1
N$124: IC7.4(QE) R37.1
N$125: IC7.5(QF) R38.1
N$126: IC7.6(QG) R39.1
N$127: IC7.7(QH) R40.1
N$128: R67.1(B) R73.1
N$129: R69.1(B) R76.2
N$131: R70.1(B) R77.2
N$132: IC1.4(QE) R77.1
N$133: IC1.5(QF) R78.1
N$137: LED321.K(C) LED329.K(C) LED337.K(C) LED345.K(C) LED353.K(C) LED361.K(C) LED369.K(C) LED377.K(C) R41.2
N$138: LED323.K(C) LED331.K(C) LED339.K(C) LED347.K(C) LED355.K(C) LED363.K(C) LED371.K(C) LED379.K(C) R43.2
N$139: LED324.K(C) LED332.K(C) LED340.K(C) LED348.K(C) LED356.K(C) LED364.K(C) LED372.K(C) LED380.K(C) R44.2
N$140: LED325.K(C) LED333.K(C) LED341.K(C) LED349.K(C) LED357.K(C) LED365.K(C) LED373.K(C) LED381.K(C) R45.2
N$141: LED326.K(C) LED334.K(C) LED342.K(C) LED350.K(C) LED358.K(C) LED366.K(C) LED374.K(C) LED382.K(C) R46.2
N$142: LED327.K(C) LED335.K(C) LED343.K(C) LED351.K(C) LED359.K(C) LED367.K(C) LED375.K(C) LED383.K(C) R47.2
N$143: LED328.K(C) LED336.K(C) LED344.K(C) LED352.K(C) LED360.K(C) LED368.K(C) LED376.K(C) LED384.K(C) R48.2
N$144: IC8.15(QA) R41.1
N$145: IC8.1(QB) R42.1
N$146: IC8.2(QC) R43.1
N$147: IC8.3(QD) R44.1
N$148: IC8.4(QE) R45.1
N$149: IC8.5(QF) R46.1
N$150: IC8.6(QG) R47.1
N$151: IC8.7(QH) R48.1
N$159: IC1.6(QG) R79.1
N$160: LED385.K(C) LED393.K(C) LED401.K(C) LED409.K(C) LED417.K(C) LED425.K(C) LED433.K(C) LED441.K(C) R49.2
N$161: LED386.K(C) LED394.K(C) LED402.K(C) LED410.K(C) LED418.K(C) LED426.K(C) LED434.K(C) LED442.K(C) R50.2
N$162: LED387.K(C) LED395.K(C) LED403.K(C) LED411.K(C) LED419.K(C) LED427.K(C) LED435.K(C) LED443.K(C) R51.2
N$163: LED388.K(C) LED396.K(C) LED404.K(C) LED412.K(C) LED420.K(C) LED428.K(C) LED436.K(C) LED444.K(C) R52.2
N$164: LED389.K(C) LED397.K(C) LED405.K(C) LED413.K(C) LED421.K(C) LED429.K(C) LED437.K(C) LED445.K(C) R53.2
N$165: LED390.K(C) LED398.K(C) LED406.K(C) LED414.K(C) LED422.K(C) LED430.K(C) LED438.K(C) LED446.K(C) R54.2
N$166: LED391.K(C) LED399.K(C) LED407.K(C) LED415.K(C) LED423.K(C) LED431.K(C) LED439.K(C) LED447.K(C) R55.2
N$167: LED392.K(C) LED400.K(C) LED408.K(C) LED416.K(C) LED424.K(C) LED432.K(C) LED440.K(C) LED448.K(C) R56.2
N$168: IC9.15(QA) R49.1
N$169: IC9.1(QB) R50.1
N$170: IC9.2(QC) R51.1
N$171: IC9.3(QD) R52.1
N$172: IC9.4(QE) R53.1
N$173: IC9.5(QF) R54.1
N$174: IC9.6(QG) R55.1
N$175: IC9.7(QH) R56.1
N$183: R72.1(B) R79.2
N$184: LED449.K(C) LED457.K(C) LED465.K(C) LED473.K(C) LED481.K(C) LED489.K(C) LED497.K(C) LED505.K(C) R57.2
N$185: LED451.K(C) LED459.K(C) LED467.K(C) LED475.K(C) LED483.K(C) LED491.K(C) LED499.K(C) LED507.K(C) R59.2
N$186: LED452.K(C) LED460.K(C) LED468.K(C) LED476.K(C) LED484.K(C) LED492.K(C) LED500.K(C) LED508.K(C) R60.2
N$187: LED453.K(C) LED461.K(C) LED469.K(C) LED477.K(C) LED485.K(C) LED493.K(C) LED501.K(C) LED509.K(C) R61.2
N$188: LED454.K(C) LED462.K(C) LED470.K(C) LED478.K(C) LED486.K(C) LED494.K(C) LED502.K(C) LED510.K(C) R62.2
N$189: LED455.K(C) LED463.K(C) LED471.K(C) LED479.K(C) LED487.K(C) LED495.K(C) LED503.K(C) LED511.K(C) R63.2
N$190: LED456.K(C) LED464.K(C) LED472.K(C) LED480.K(C) LED488.K(C) LED496.K(C) LED504.K(C) LED512.K(C) R64.2
N$191: IC10.15(QA) R57.1
N$192: IC10.1(QB) R58.1
N$193: IC10.2(QC) R59.1
N$194: IC10.3(QD) R60.1
N$195: IC10.4(QE) R61.1
N$196: IC10.5(QF) R62.1
N$197: IC10.6(QG) R63.1
N$198: IC10.7(QH) R64.1
N$207: LED322.K(C) LED330.K(C) LED338.K(C) LED346.K(C) LED354.K(C) LED362.K(C) LED370.K(C) LED378.K(C) R42.2
N$208: LED450.K(C) LED458.K(C) LED466.K(C) LED474.K(C) LED482.K(C) LED490.K(C) LED498.K(C) LED506.K(C) R58.2
N$209: IC1.7(QH) R80.1
N$210: R65.1(B) R80.2
VCC: IC1.10(!SCLR) IC1.16(VCC) IC2.10(!SCLR) IC2.16(VCC) IC3.10(!SCLR) IC3.16(VCC) IC4.10(!SCLR) IC4.16(VCC) IC5.10(!SCLR) IC5.16(VCC) IC7.10(!SCLR) IC7.16(VCC) IC8.10(!SCLR) IC8.16(VCC) IC9.10(!SCLR) IC9.16(VCC) IC10.10(!SCLR) IC10.16(VCC) SV3.2
Unconnected: IC1.9(QH') IC10.9(QH')

## Library data of the parts
IC1-IC5 IC7-IC10 = 74HC595:74HC595: 8-bit SHIFT REGISTER, output latch Check availability <https://pricing.snapeda.com/parts/74HC595/Nexperia/view-part?ref=eda>; AVAILABILITY: In Stock; DESCRIPTION: Shift Register Single 8-Bit Serial to Serial/Parallel 16-Pin SSOP T/R; MF: Nexperia; MP: 74HC595; PACKAGE: None; PRICE: None
LED1-LED512 = led:LED: LED OSRAM: - CHIPLED LG R971, LG N971, LY N971, LG Q971, LY Q971, LO R971, LY R971 LH N974, LH R974 LS Q976, LO Q976, LY Q976 LO Q996 - Hyper CHIPLED LW Q18S LB Q993, LB Q99A, LB R99A - SideLED LS A670, LO A670, LY A670, LG A670, LP A670 LB A673, LV A673, LT A673, LW A673 LH A674 LY A675 LS A676, LA A676, LO A676, LY A676, LW A676 LS A679, LY A679, LG A679 - Hyper Micro SIDELED® LS Y876, LA Y876, LO Y876, LY Y876 LT Y87S - SmartLED LW L88C, LW L88S LB L89C, LB L89S, LG L890 LS L89K, LO L89K, LY L89K LS L896, LA L896, LO L896, LY L896 - TOPLED LS T670, LO T670, LY T670, LG T670, LP T670 LSG T670, LSP T670, LSY T670, LOP T670, LYG T670 LG T671, LOG T671, LSG T671 LB T673, LV T673, LT T673, LW T673 LH T674 LS T676, LA T676, LO T676, LY T676, LB T676, LH T676, LSB T676, LW T676 LB T67C, LV T67C, LT T67C, LS T67K, LO T67K, LY T67K, LW E67C LS E67B, LA E67B, LO E67B, LY E67B, LB E67C, LV E67C, LT E67C LW T67C LS T679, LY T679, LG T679 LS T770, LO T770, LY T770, LG T770, LP T770 LB T773, LV T773, LT T773, LW T773 LH T774 LS E675, LA E675, LY E675, LS T675 LS T776, LA T776, LO T776, LY T776, LB T776 LHGB T686 LT T68C, LB T68C - Hyper Mini TOPLED® LB M676 - Mini TOPLED Santana® LG M470 LS M47K, LO M47K, LY M47K Source: http://www.osram.convergy.de LUXEON: - LUMILED® LXK2-PW12-R00, LXK2-PW12-S00, LXK2-PW14-U00, LXK2-PW14-V00 LXK2-PM12-R00, LXK2-PM12-S00, LXK2-PM14-U00 LXK2-PE12-Q00, LXK2-PE12-R00, LXK2-PE12-S00, LXK2-PE14-T00, LXK2-PE14-U00 LXK2-PB12-K00, LXK2-PB12-L00, LXK2-PB12-M00, LXK2-PB14-N00, LXK2-PB14-P00, LXK2-PB14-Q00 LXK2-PR12-L00, LXK2-PR12-M00, LXK2-PR14-Q00, LXK2-PR14-R00 LXK2-PD12-Q00, LXK2-PD12-R00, LXK2-PD12-S00 LXK2-PH12-R00, LXK2-PH12-S00 LXK2-PL12-P00, LXK2-PL12-Q00, LXK2-PL12-R00 Source: www.luxeon.com KINGBRIGHT: KA-3528ASYC Source: www.kingbright.com
R1-R64 R73-R80 = rcl:R-EU_: RESISTOR, European symbol; SPICEPREFIX: R
R65-R72 = transistor:2N3704: NPN TRANSISTOR
SV1 SV2 = Connector:PINHD-2X3: PIN HEADER; CATEGORY: CONNECTOR; SUB-CATEGORY: PIN-HEADER
SV3 = Connector:2828XX-2: 2 Position Wire to Board Terminal Block Horizontal with Board Datasheet <https://www.te.com.cn/commerce/DocumentDelivery/DDEController?Action=showdoc&DocId=Catalog+Section%7F1308389_EUROSTYLE_TERMINAL_BLOCKS%7F0607%7Fpdf%7FEnglish%7FENG_CS_1308389_EUROSTYLE_TERMINAL_BLOCKS_0607.pdf%7F2-282837-5>; CATEGORY: Connector; DESCRIPTION: 2 Position Wire to Board Terminal Block Horizontal with Board 5.08 mm Through Hole; MANUFACTURER: TE Connectivity; MPN: 282837-2; OPERATING_TEMPERATURE: -40°C to +105°C; PART_STATUS: ACTIVE; ROHS_COMPLIANCE: RoHS Compliant; SERIES: 282837; SUBCATEGORY: Terminal Block; TYPE: Side Wire Entry